# EAGLE design main (EAGLE 8.0.1)
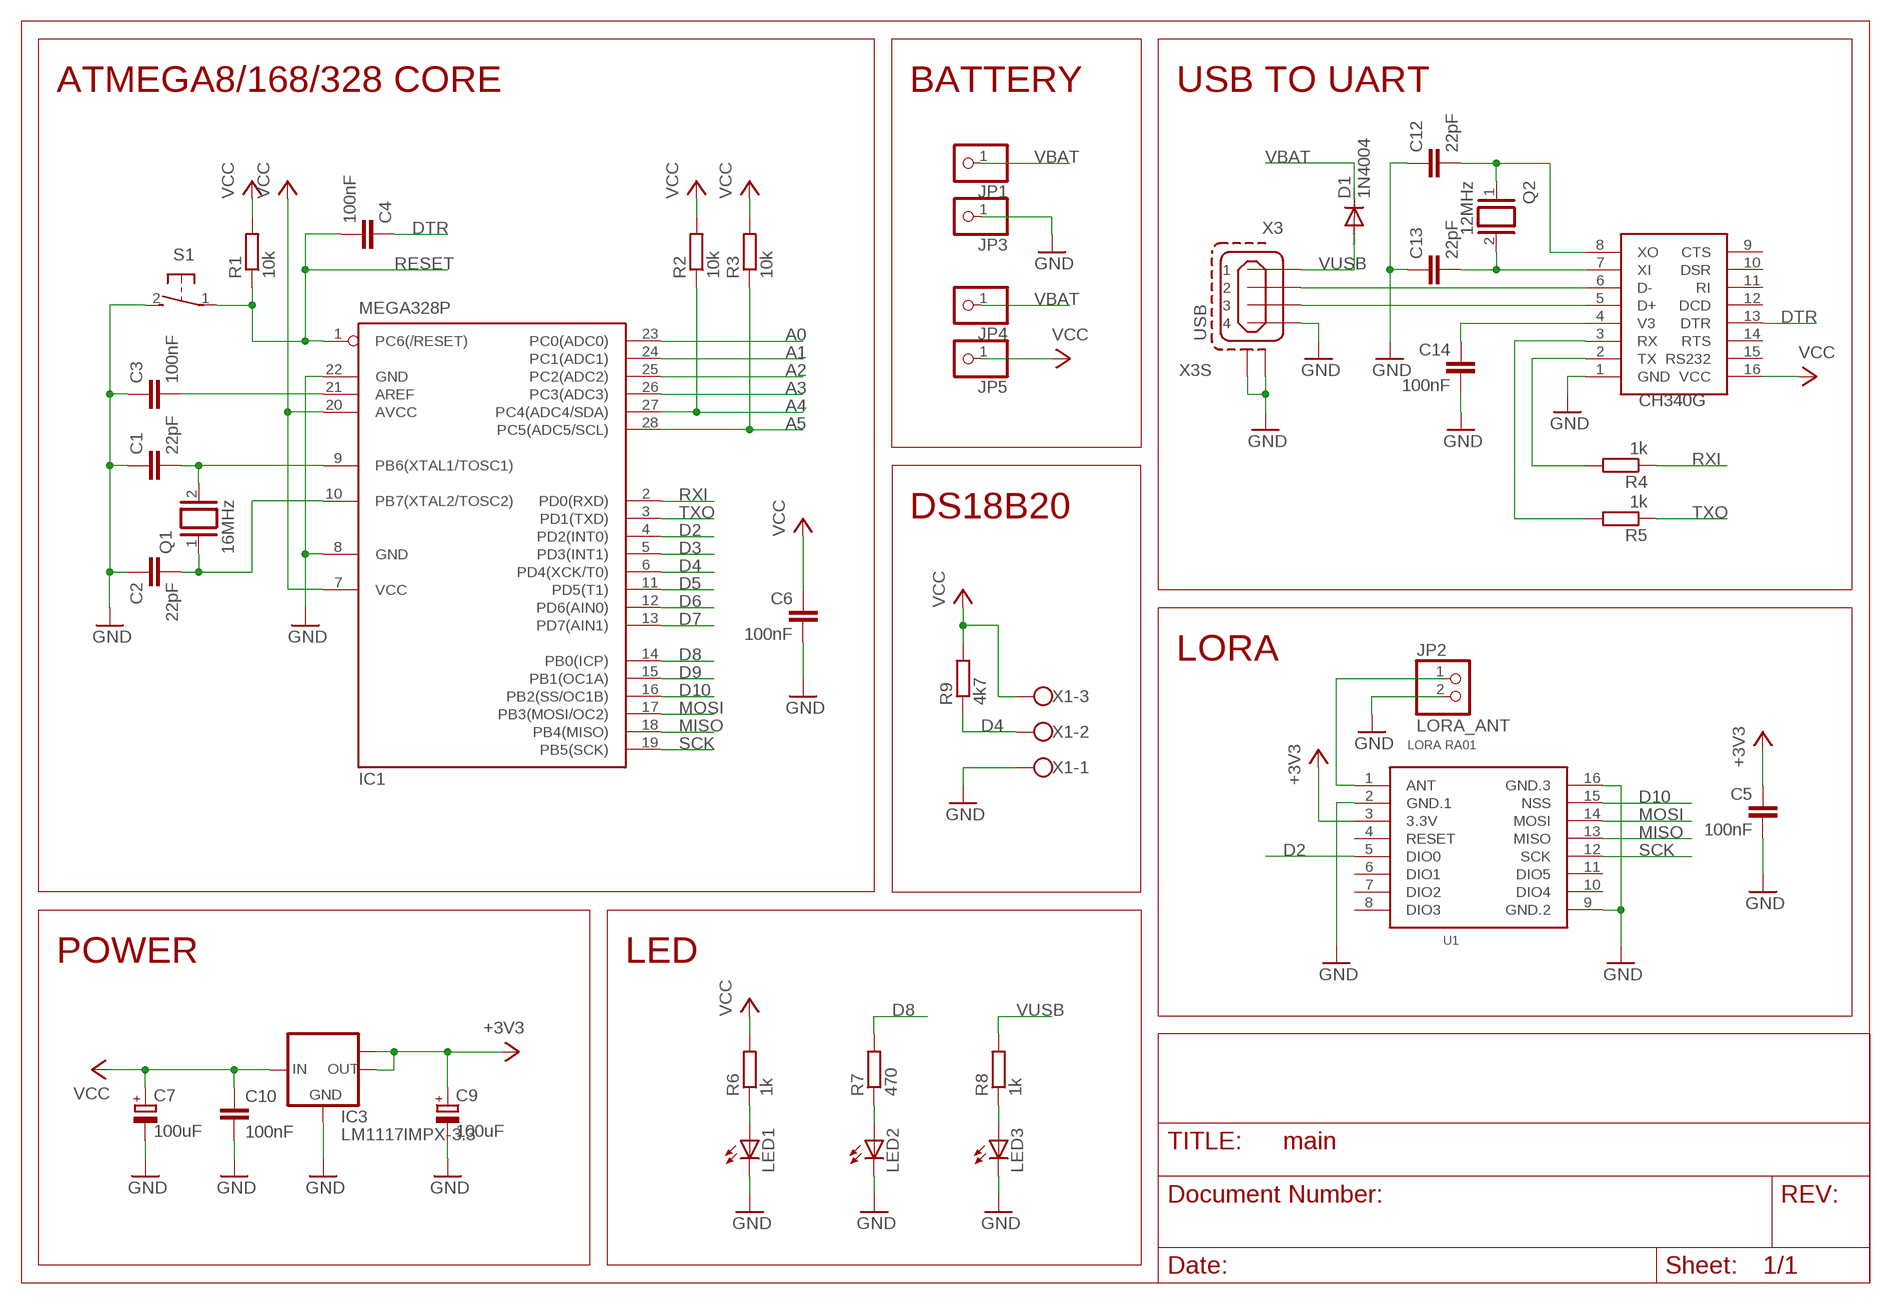
[diagram p0: schematic, sheet 1]

## Parts
C1  22pF  C-EU050-024X044  [C050-024X044]
C2  22pF  C-EU050-024X044  [C050-024X044]
C3  100nF  C-EU050-024X044  [C050-024X044]
C4  100nF  C-EU050-024X044  [C050-024X044]
C5  100nF  C-EU050-024X044  [C050-024X044]
C6  100nF  C-EU050-024X044  [C050-024X044]
C7  100uF  CPOL-EUE3.5-10  [E3,5-10]
C9  100uF  CPOL-EUE3.5-8  [E3,5-8]
C10  100nF  C-EU050-024X044  [C050-024X044]
C12  22pF  C-EU050-024X044  [C050-024X044]
C13  22pF  C-EU050-024X044  [C050-024X044]
C14  100nF  C-EU050-024X044  [C050-024X044]
D1  1N4004  [DO41-10]
IC1  MEGA328P  MEGA8-P  [DIL28-3]
IC3  LM1117IMPX-3.3  [SOT223]
JP1  PINHD-1X1  [1X01]
JP2  LORA_ANT  PINHD-1X2  [1X02]
JP3  PINHD-1X1  [1X01]
JP4  PINHD-1X1  [1X01]
JP5  PINHD-1X1  [1X01]
LED1  LED3MM  [LED3MM]
LED2  LED3MM  [LED3MM]
LED3  LED3MM  [LED3MM]
Q1  16MHz  XTAL/S  [QS]
Q2  12MHz  XTAL/S  [QS]
R1  10k  R-EU_0207/10  [0207/10]
R2  10k  R-EU_0207/10  [0207/10]
R3  10k  R-EU_0207/10  [0207/10]
R4  1k  R-EU_0207/10  [0207/10]
R5  1k  R-EU_0207/10  [0207/10]
R6  1k  R-EU_0207/10  [0207/10]
R7  470  R-EU_0207/10  [0207/10]
R8  1k  R-EU_0207/10  [0207/10]
R9  4k7  R-EU_0207/10  [0207/10]
S1  31-XX  [B3F-31XX]
U1  LORA RA01  LORA-RA-01-433MHZ  [LORA-RA1-SMD]
U$1  CH340G  [SOIC16]
X1  W237-103  [W237-103]
X3  USB  MINI-USB_SHIELD4P-85-32004-00X  [85-32004-00X]

## Nets
+3V3: C5.1 C9.+ IC3.2(OUT) IC3.TAB(OUT1) U1.3(3.3V)
A0: IC1.23(PC0(ADC0))
A1: IC1.24(PC1(ADC1))
A2: IC1.25(PC2(ADC2))
A3: IC1.26(PC3(ADC3))
A4: IC1.27(PC4(ADC4/SDA)) R2.1
A5: IC1.28(PC5(ADC5/SCL)) R3.1
D2: IC1.4(PD2(INT0)) U1.5(DIO0)
D3: IC1.5(PD3(INT1))
D4: IC1.6(PD4(XCK/T0)) R9.1 X1.2
D5: IC1.11(PD5(T1))
D6: IC1.12(PD6(AIN0))
D7: IC1.13(PD7(AIN1))
D8: IC1.14(PB0(ICP)) R7.2
D9: IC1.15(PB1(OC1A))
D10: IC1.16(PB2(SS/OC1B)) U1.15(NSS)
DTR: C4.1 U$1.13(DTR)
GND: C1.1 C2.1 C3.1 C5.2 C6.2 C7.- C9.- C10.2 C12.1 C13.1 C14.2 IC1.8(GND) IC1.22(GND) IC3.1(GND) JP2.2 JP3.1 LED1.K(C) LED2.K(C) LED3.K(C) S1.2(S) U1.2(GND.1) U1.9(GND.2) U1.16(GND.3) U$1.1(GND) X1.1 X3.4 X3.M1(S1) X3.M2(S2)
MISO: IC1.18(PB4(MISO)) U1.13(MISO)
MOSI: IC1.17(PB3(MOSI/OC2)) U1.14(MOSI)
N$1: JP2.1 U1.1(ANT)
N$2: LED3.A R8.1
N$3: U$1.6(D-) X3.2
N$5: C1.2 IC1.9(PB6(XTAL1/TOSC1)) Q1.2
N$6: C2.2 IC1.10(PB7(XTAL2/TOSC2)) Q1.1
N$8: C3.2 IC1.21(AREF)
N$9: LED1.A R6.1
N$10: LED2.A R7.1
N$12: U$1.5(D+) X3.3
N$13: C12.2 Q2.1 U$1.8(XO)
N$14: C13.2 Q2.2 U$1.7(XI)
N$16: C14.1 U$1.4(V3)
N$17: R5.2 U$1.3(RX)
N$18: R4.2 U$1.2(TX)
RESET: C4.2 IC1.1(PC6(/RESET)) R1.1 S1.1(P)
RXI: IC1.2(PD0(RXD)) R4.1
SCK: IC1.19(PB5(SCK)) U1.12(SCK)
TXO: IC1.3(PD1(TXD)) R5.1
VBAT: D1.C JP1.1 JP4.1
VCC: C6.1 C7.+ C10.1 IC1.7(VCC) IC1.20(AVCC) IC3.3(IN) JP5.1 R1.2 R2.2 R3.2 R6.2 R9.2 U$1.16(VCC) X1.3
VUSB: D1.A R8.2 X3.1
Unconnected: U1.4(RESET) U1.6(DIO1) U1.7(DIO2) U1.8(DIO3) U1.10(DIO4) U1.11(DIO5) U$1.9(CTS) U$1.10(DSR) U$1.11(RI) U$1.12(DCD) U$1.14(RTS) U$1.15(RS232)

## Notes on the sheet
- ATMEGA8/168/328 CORE | BATTERY | USB TO UART
- DS18B20
- LORA
- POWER | LED

## Library data of the parts
C1-C6 C10 C12-C14 = rcl:C-EU: CAPACITOR, European symbol
C7 C9 = rcl:CPOL-EU: POLARIZED CAPACITOR, European symbol
D1 = diode:1N4004: DIODE general purpose rectifier, 1 A
IC1 = atmel:MEGA8-P: MICROCONTROLLER 8 Kbytes FLASH, 1 kbytes SRAM, 512 bytes EEPROM, USART, 4-channel 10 bit ADC, 2-channel 8 bit ADC Pin compatible with Atmega48, ATMega88, ATMega168 Source: avr.lbr; OC_FARNELL: unknown; OC_NEWARK: unknown
IC3 = lm1117:LM1117IMPX-*
JP1 JP3-JP5 = pinhead:PINHD-1X1: PIN HEADER
JP2 = pinhead:PINHD-1X2: PIN HEADER
LED1-LED3 = led:LED: LED OSRAM: - CHIPLED LG R971, LG N971, LY N971, LG Q971, LY Q971, LO R971, LY R971 LH N974, LH R974 LS Q976, LO Q976, LY Q976 LO Q996 - Hyper CHIPLED LW Q18S LB Q993, LB Q99A, LB R99A - SideLED LS A670, LO A670, LY A670, LG A670, LP A670 LB A673, LV A673, LT A673, LW A673 LH A674 LY A675 LS A676, LA A676, LO A676, LY A676, LW A676 LS A679, LY A679, LG A679 - Hyper Micro SIDELED® LS Y876, LA Y876, LO Y876, LY Y876 LT Y87S - SmartLED LW L88C, LW L88S LB L89C, LB L89S, LG L890 LS L89K, LO L89K, LY L89K LS L896, LA L896, LO L896, LY L896 - TOPLED LS T670, LO T670, LY T670, LG T670, LP T670 LSG T670, LSP T670, LSY T670, LOP T670, LYG T670 LG T671, LOG T671, LSG T671 LB T673, LV T673, LT T673, LW T673 LH T674 LS T676, LA T676, LO T676, LY T676, LB T676, LH T676, LSB T676, LW T676 LB T67C, LV T67C, LT T67C, LS T67K, LO T67K, LY T67K, LW E67C LS E67B, LA E67B, LO E67B, LY E67B, LB E67C, LV E67C, LT E67C LW T67C LS T679, LY T679, LG T679 LS T770, LO T770, LY T770, LG T770, LP T770 LB T773, LV T773, LT T773, LW T773 LH T774 LS E675, LA E675, LY E675, LS T675 LS T776, LA T776, LO T776, LY T776, LB T776 LHGB T686 LT T68C, LB T68C - Hyper Mini TOPLED® LB M676 - Mini TOPLED Santana® LG M470 LS M47K, LO M47K, LY M47K Source: http://www.osram.convergy.de LUXEON: - LUMILED® LXK2-PW12-R00, LXK2-PW12-S00, LXK2-PW14-U00, LXK2-PW14-V00 LXK2-PM12-R00, LXK2-PM12-S00, LXK2-PM14-U00 LXK2-PE12-Q00, LXK2-PE12-R00, LXK2-PE12-S00, LXK2-PE14-T00, LXK2-PE14-U00 LXK2-PB12-K00, LXK2-PB12-L00, LXK2-PB12-M00, LXK2-PB14-N00, LXK2-PB14-P00, LXK2-PB14-Q00 LXK2-PR12-L00, LXK2-PR12-M00, LXK2-PR14-Q00, LXK2-PR14-R00 LXK2-PD12-Q00, LXK2-PD12-R00, LXK2-PD12-S00 LXK2-PH12-R00, LXK2-PH12-S00 LXK2-PL12-P00, LXK2-PL12-Q00, LXK2-PL12-R00 Source: www.luxeon.com KINGBRIGHT: KA-3528ASYC Source: www.kingbright.com
Q1 Q2 = special:XTAL/S: CRYSTAL
R1-R9 = rcl:R-EU_: RESISTOR, European symbol
S1 = switch-omron:31-XX: OMRON SWITCH; MPN: B3F-3100; OC_FARNELL: 959704; OC_NEWARK: 36M3582
U1 = lora:LORA-RA-01-433MHZ: 433 MHz Lora Ra-01 Radio Transceiver Module based on SX1278 chip.
U$1 = ch340g:CH340G
X1 = con-wago-500:W237-103: WAGO SCREW CLAMP; MPN: 237-103; OC_FARNELL: unknown; OC_NEWARK: 18M7116
X3 = con-cypressindustries:MINI-USB_SHIELD4P-: MINI USB 4 Pol. Source: www.cypressindustries.com; OC_FARNELL: unknown; OC_NEWARK: unknown

## Board
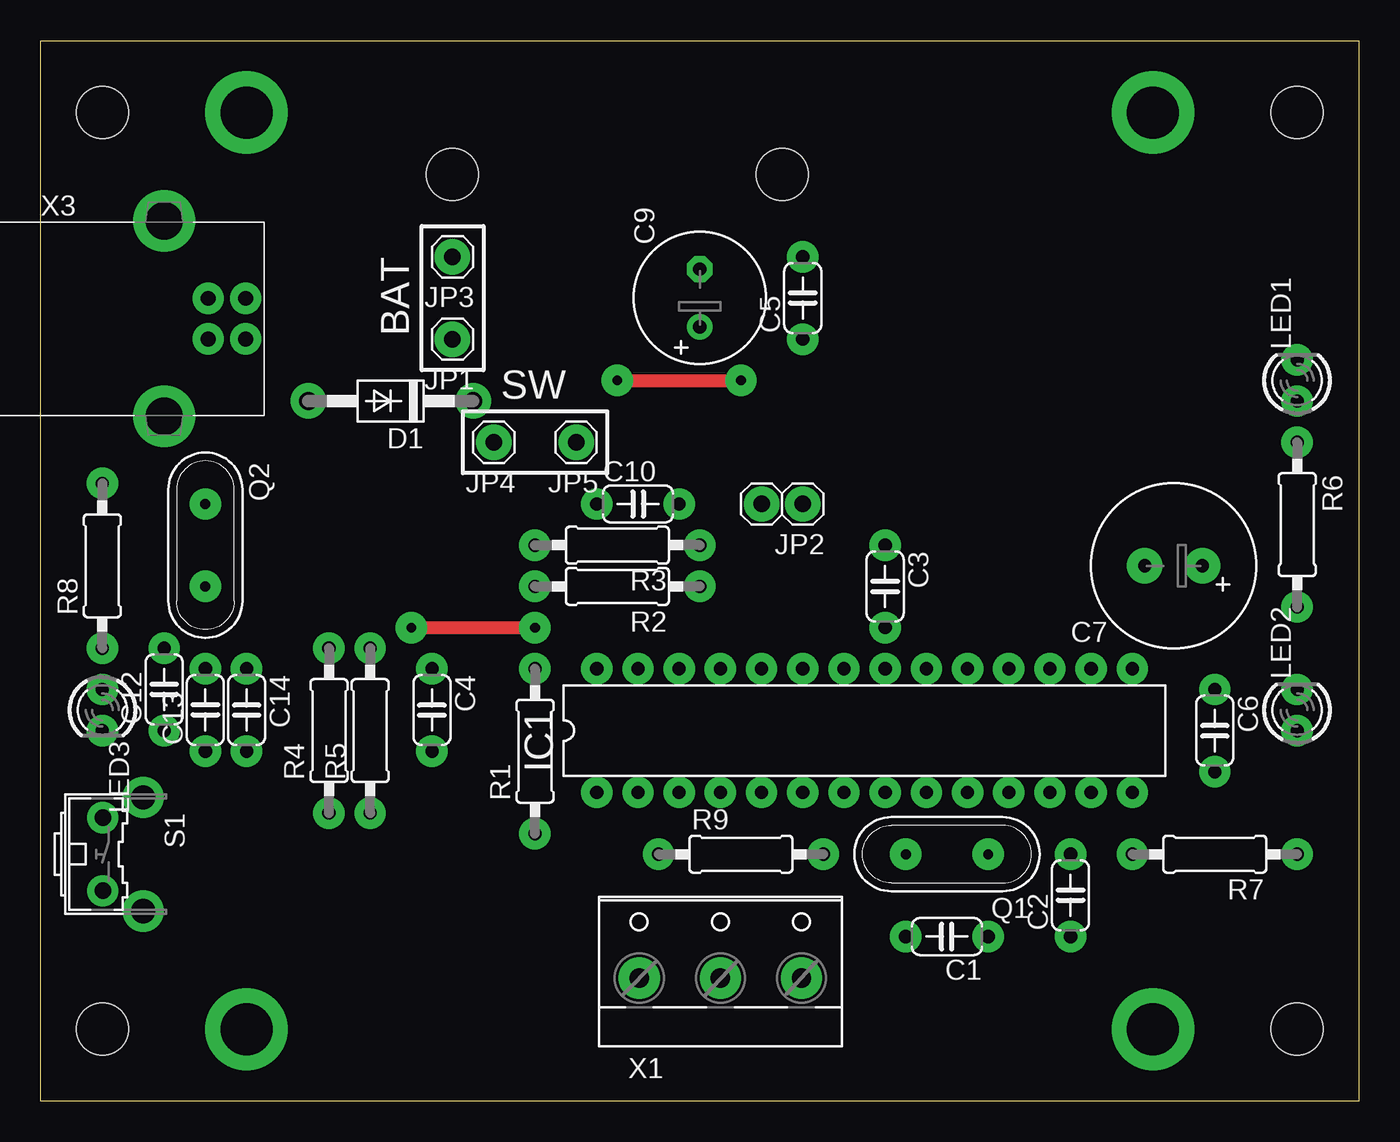
[diagram p1: board, top side]
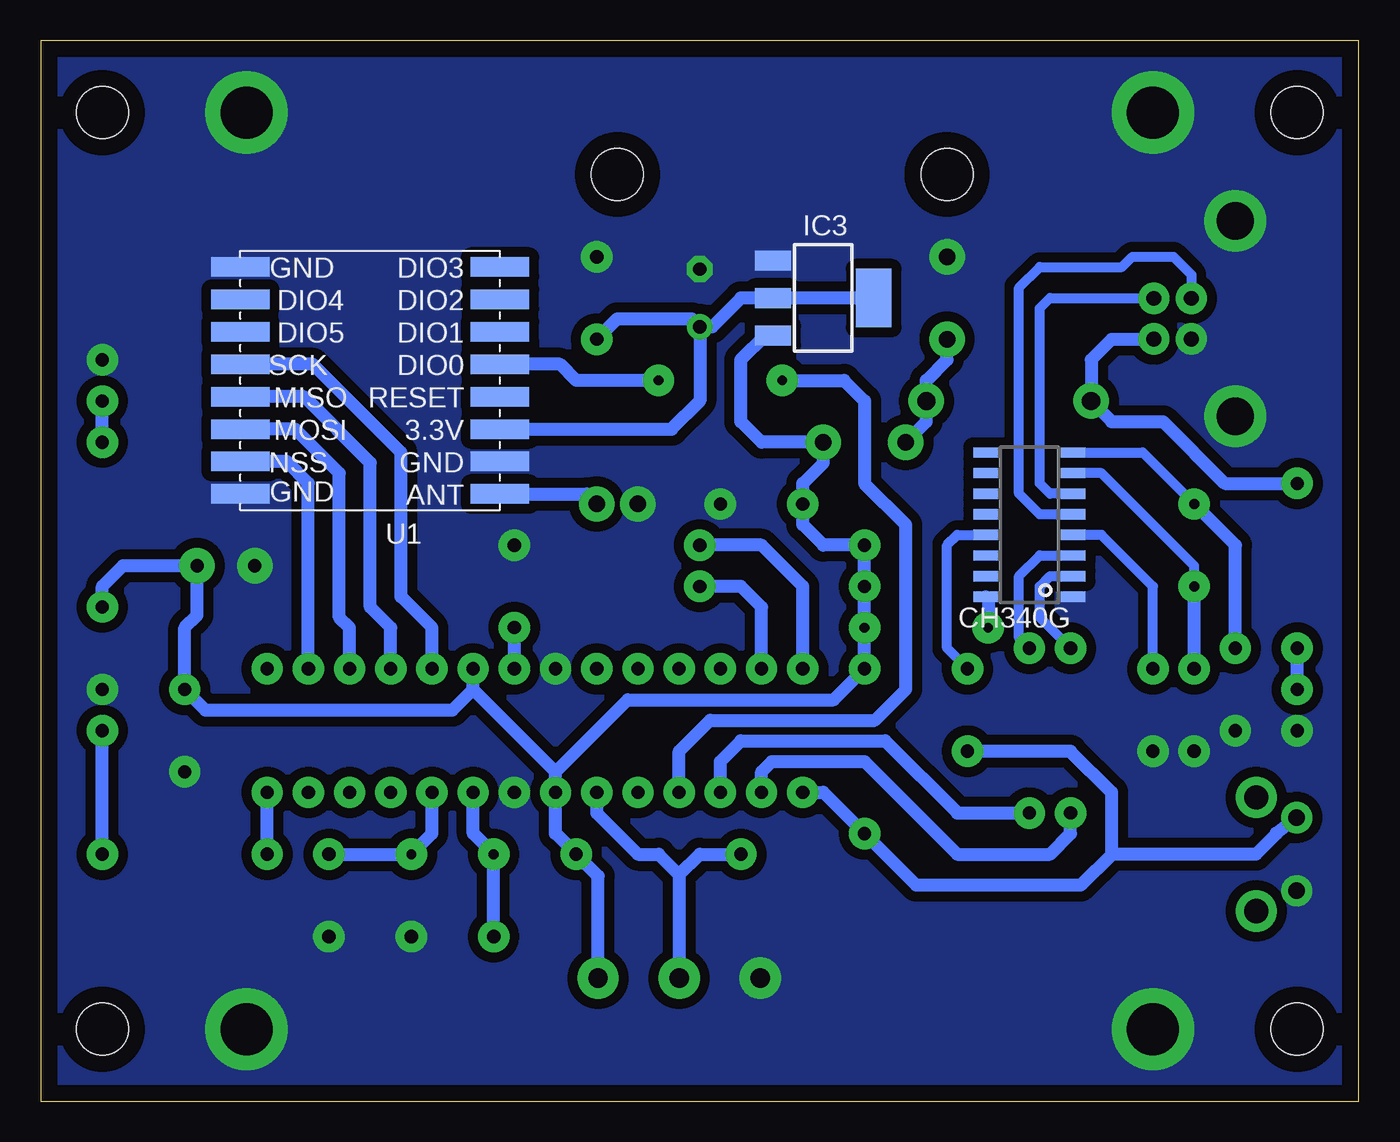
[diagram p2: board, bottom side, seen from below]

Size 81.28 x 65.41 mm. Coordinates in mm from the lower left corner, seen from the top.
Outline: 81.28,0 0,0 0,65.41 81.28,65.41 81.28,0
Copper layers (1*16): Top 0.035mm / dielectric 1.5mm / Bottom 0.035mm
Design rules "default": minimum track width 10mil, minimum drill 24mil, track to track 8mil, track to pad 8mil, pad to pad 8mil, via to via 8mil, smd to smd 8mil, copper to edge 40mil, drill to drill 8mil, minimum pad ring 10mil, minimum via ring 8mil, stop-mask expansion 4mil, vias tented up to drill 0mil, thermal gap 10mil
Holes 3.2 mm at 77.47,4.45 77.47,60.96 3.81,60.96 3.81,4.45 25.4,57.15 45.72,57.15

### Footprints (pad centres in the part's own frame; a part is rotated, then mirrored left to right if it is on the bottom)
C050-024X044 = drill 0.813 pad 1.93: 1 -2.54,0; 2 2.54,0
E3,5-10 = drill 0.813 pad 2.184: + -1.778,0; - 1.778,0
E3,5-8 = drill 0.813 pad 1.6: + -1.778,0 | drill 0.813 pad 1.6 octagon: - 1.778,0
DO41-10 = drill 1.118 pad 2.184: A 5.08,0; C -5.08,0
DIL28-3 = drill 0.813 pad 1.93: 1 -16.51,-3.81; 2 -13.97,-3.81; 3 -11.43,-3.81; 4 -8.89,-3.81; 5 -6.35,-3.81; 6 -3.81,-3.81; 7 -1.27,-3.81; 8 1.27,-3.81; 9 3.81,-3.81; 10 6.35,-3.81; 11 8.89,-3.81; 12 11.43,-3.81; 13 13.97,-3.81; 14 16.51,-3.81; 15 16.51,3.81; 16 13.97,3.81; 17 11.43,3.81; 18 8.89,3.81; 19 6.35,3.81; 20 3.81,3.81; 21 1.27,3.81; 22 -1.27,3.81; 23 -3.81,3.81; 24 -6.35,3.81; 25 -8.89,3.81; 26 -11.43,3.81; 27 -13.97,3.81; 28 -16.51,3.81
SOT223 = smd 1.219 x 2.235: 1 -2.311,-3.099; 2 0,-3.099; 3 2.311,-3.099 | smd 3.6 x 2.2: TAB 0,3.099
1X01 = drill 1.016 pad 2.184: 1 0,0
1X02 = drill 1.016 pad 2.184: 1 -1.27,0; 2 1.27,0
LED3MM = drill 0.813 pad 1.93: A -1.27,0; K 1.27,0
QS = drill 0.61 pad 1.93: 1 -2.54,0; 2 2.54,0
0207/10 = drill 0.813 pad 1.93: 1 -5.08,0; 2 5.08,0
B3F-31XX = drill 1.016 pad 1.93: 1 -2.261,-1.245; 2 2.261,-1.245 | drill 1.499 pad 2.54: 3 -3.505,1.245; 4 3.505,1.245
LORA-RA1-SMD = smd 3.6 x 1.2: 1 -8,7; 2 -8,5; 3 -8,3; 4 -8,1; 5 -8,-1; 6 -8,-3; 7 -8,-5; 8 -8,-7; 9 8,-7; 10 8,-5; 11 8,-3; 12 8,-1; 13 8,1; 14 8,3; 15 8,5; 16 8,7
SOIC16 = smd 0.635 x 1.524: 1 -4.445,-2.695; 2 -3.175,-2.695; 3 -1.905,-2.695; 4 -0.635,-2.695; 5 0.635,-2.695; 6 1.905,-2.695; 7 3.175,-2.695; 8 4.445,-2.695; 9 4.445,2.695; 10 3.175,2.695; 11 1.905,2.695; 12 0.635,2.695; 13 -0.635,2.695; 14 -1.905,2.695; 15 -3.175,2.695; 16 -4.445,2.695
W237-103 = drill 1.194 pad 2.54: 1 -5,-1.29; 2 0,-1.29; 3 5,-1.29
85-32004-00X = drill 0.92 pad 1.93: 1 5.027,-1.25; 2 5.027,1.25; 3 2.71,1.25; 4 2.71,-1.25 | drill 2.3 pad 3.81: M1 0,6.02; M2 0,-6.02

### Placement (x,y rotation side)
C1  55.88,10.16 180 top
C2  63.5,12.7 90 top
C3  52.07,31.75 270 top
C4  24.13,24.13 270 top
C5  46.99,49.53 90 top
C6  72.39,22.86 270 top
C7  69.85,33.02 180 top
C9  40.64,49.53 90 top
C10  36.83,36.83 0 top
C12  7.62,25.4 90 top
C13  10.16,24.13 90 top
C14  12.7,24.13 270 top
D1  21.59,43.18 180 top
IC1  50.8,22.86 0 top
IC3  33.02,49.53 270 bottom
JP1  25.4,46.99 180 top
JP2  45.72,36.83 180 top
JP3  25.4,52.07 180 top
JP4  27.94,40.64 180 top
JP5  33.02,40.64 180 top
LED1  77.47,44.45 90 top
LED2  77.47,24.13 90 top
LED3  3.81,24.13 270 top
Q1  55.88,15.24 180 top
Q2  10.16,34.29 270 top
R1  30.48,21.59 90 top
R2  35.56,31.75 180 top
R3  35.56,34.29 180 top
R4  17.78,22.86 90 top
R5  20.32,22.86 90 top
R6  77.47,35.56 270 top
R7  72.39,15.24 180 top
R8  3.81,33.02 90 top
R9  43.18,15.24 0 top
S1  5.08,15.24 270 top
U1  60.96,44.45 180 bottom
U$1  20.32,35.56 90 bottom
X1  41.91,8.89 0 top
X3  7.62,48.26 0 top

### Tracks (layer width: path | path; a pad name or v marks a point on that pad's centre or on a via)
+3V3
  Bottom 0.813: IC3.TAB IC3.2 38.1,49.53 39.88,47.75 C9.+ | C9.+ 40.64,43.18 42.37,41.45 U1.3 | C5.1 45.72,48.26 41.15,48.26 C9.+
A4
  Bottom 0.813: R2.1 38.1,31.75 36.83,30.48 IC1.27
A5
  Bottom 0.813: R3.1 36.83,34.29 34.29,31.75 IC1.28
D2  (via drill 0.6 pad 1.93)
  Top 0.813: v35.56,44.45 v43.18,44.45
  Bottom 0.813: IC1.4 41.91,21.59 40.01,23.5 29.84,23.5 27.94,25.4 27.94,35.56 30.48,38.1 30.48,43.18 31.75,44.45 v35.56,44.45 | v43.18,44.45 48.26,44.45 49.26,45.45 U1.5
D4
  Bottom 0.813: 41.91,13.97 X1.2 | 41.91,13.97 40.64,15.24 R9.1 | IC1.6 46.99,17.78 44.45,15.24 43.18,15.24 41.91,13.97
D8
  Bottom 0.813: R7.2 IC1.14
D10
  Bottom 0.813: IC1.16 64.77,38.1 66.12,39.45 U1.15
DTR
  Bottom 0.61: U$1.13 24.77,34.92 25.4,34.29 25.4,27.94 C4.1
GND  (via drill 3.2 pad 5.08)
  other vias: 68.58,4.45 12.7,4.45 12.7,60.96 68.58,60.96
  pour Bottom (isolate 0.61, no thermals): 81.28,0 0,0 0,65.41 81.28,65.41
MISO
  Bottom 0.813: IC1.18 59.69,29.21 60.96,30.48 60.96,39.37 65.04,43.45 U1.13
MOSI
  Bottom 0.813: IC1.17 62.23,29.21 62.87,29.84 62.87,38.73 65.58,41.45 U1.14
N$1
  Bottom 0.813: U1.1 47.61,37.45 JP2.1
N$2
  Bottom 0.813: LED3.A R8.1
N$3
  Bottom 0.61: U$1.6 19.05,37.47 19.68,38.1 19.68,48.9 19.05,49.53 12.67,49.53
  Bottom 0.813: 12.67,49.53 X3.2
N$5
  Bottom 0.813: IC1.9 54.61,16.51 Q1.2 C1.2
N$6
  Bottom 0.813: IC1.10 57.15,16.51 Q1.1 C2.2
N$8
  Bottom 0.813: IC1.21 C3.2
N$9
  Bottom 0.813: R6.1 LED1.A
N$10
  Bottom 0.813: R7.1 LED2.A
N$12
  Bottom 0.61: U$1.5 19.68,36.2 20.95,37.47 20.95,50.16 19.68,51.44 14.61,51.44 13.97,52.07 11.43,52.07 10.33,50.97 X3.3
N$13
  Bottom 0.61: U$1.8 13.34,40.01 Q2.1
  Bottom 0.813: Q2.1 7.62,34.29 C12.2
N$14
  Bottom 0.61: U$1.7 15.88,38.73 10.16,33.02 Q2.2
  Bottom 0.813: C13.2 Q2.2
N$16
  Bottom 0.61: C14.1 12.7,31.75 15.88,34.92 U$1.4
N$17
  Bottom 0.61: R5.2 20.95,28.57 20.95,32.38 19.68,33.66 U$1.3
N$18
  Bottom 0.61: U$1.2 19.05,32.38 19.68,31.75 19.68,29.84 R4.2
RESET
  Bottom 0.813: C4.2 17.78,21.59 15.24,19.05 15.24,15.24 | IC1.1 33.02,19.05 R1.1 27.3,13.34 17.14,13.34 15.24,15.24 | S1.1 5.11,16.54 5.08,16.51 6.35,15.24 15.24,15.24
RXI
  Bottom 0.813: IC1.2 36.83,20.32 36.2,20.95 30.48,20.95 24.77,15.24 19.05,15.24 17.78,16.51 R4.1
SCK
  Bottom 0.813: IC1.19 57.15,29.21 59.05,31.11 59.05,40.01 64.5,45.45 U1.12
TXO
  Bottom 0.813: IC1.3 39.37,20.95 38.1,22.23 29.21,22.23 24.77,17.78 R5.1
VBAT
  Bottom 0.813: JP4.1 26.67,41.91 D1.C 26.67,44.45 25.4,45.72 JP1.1
VCC  (via drill 0.6 pad 1.93)
  Top 0.813: v22.86,29.21 v30.48,29.21
  Bottom 0.813: 49.53,20.32 IC1.7 49.53,16.51 R9.2 46.91,13.89 X1.3 | 54.61,25.4 49.53,20.32 | 54.61,25.4 IC1.20 | 49.53,20.32 45.09,24.77 32.38,24.77 R1.2 v30.48,29.21 R2.2 R3.2 33.02,34.29 34.29,35.56 C10.1 34.29,38.1 33.02,39.37 JP5.1 36.83,40.64 38.1,41.91 38.1,45.72 36.6,47.22 IC3.3 | U$1.16 22.86,30.96 v22.86,29.21 | 54.61,25.4 55.88,24.13 71.12,24.13 C6.1 72.39,29.21 71.63,29.97 C7.+ 76.2,33.02 77.47,31.75 R6.2
VUSB
  Bottom 0.813: X3.1 12.67,46.99 15.24,46.99 16.51,45.72 D1.A 15.24,41.91 12.06,41.91 8.26,38.1 R8.2

### Text on the board
tPlace: BAT | SW